# Altium schematic sheet riskybirdv3.SchDoc
size 594 x 420 mm
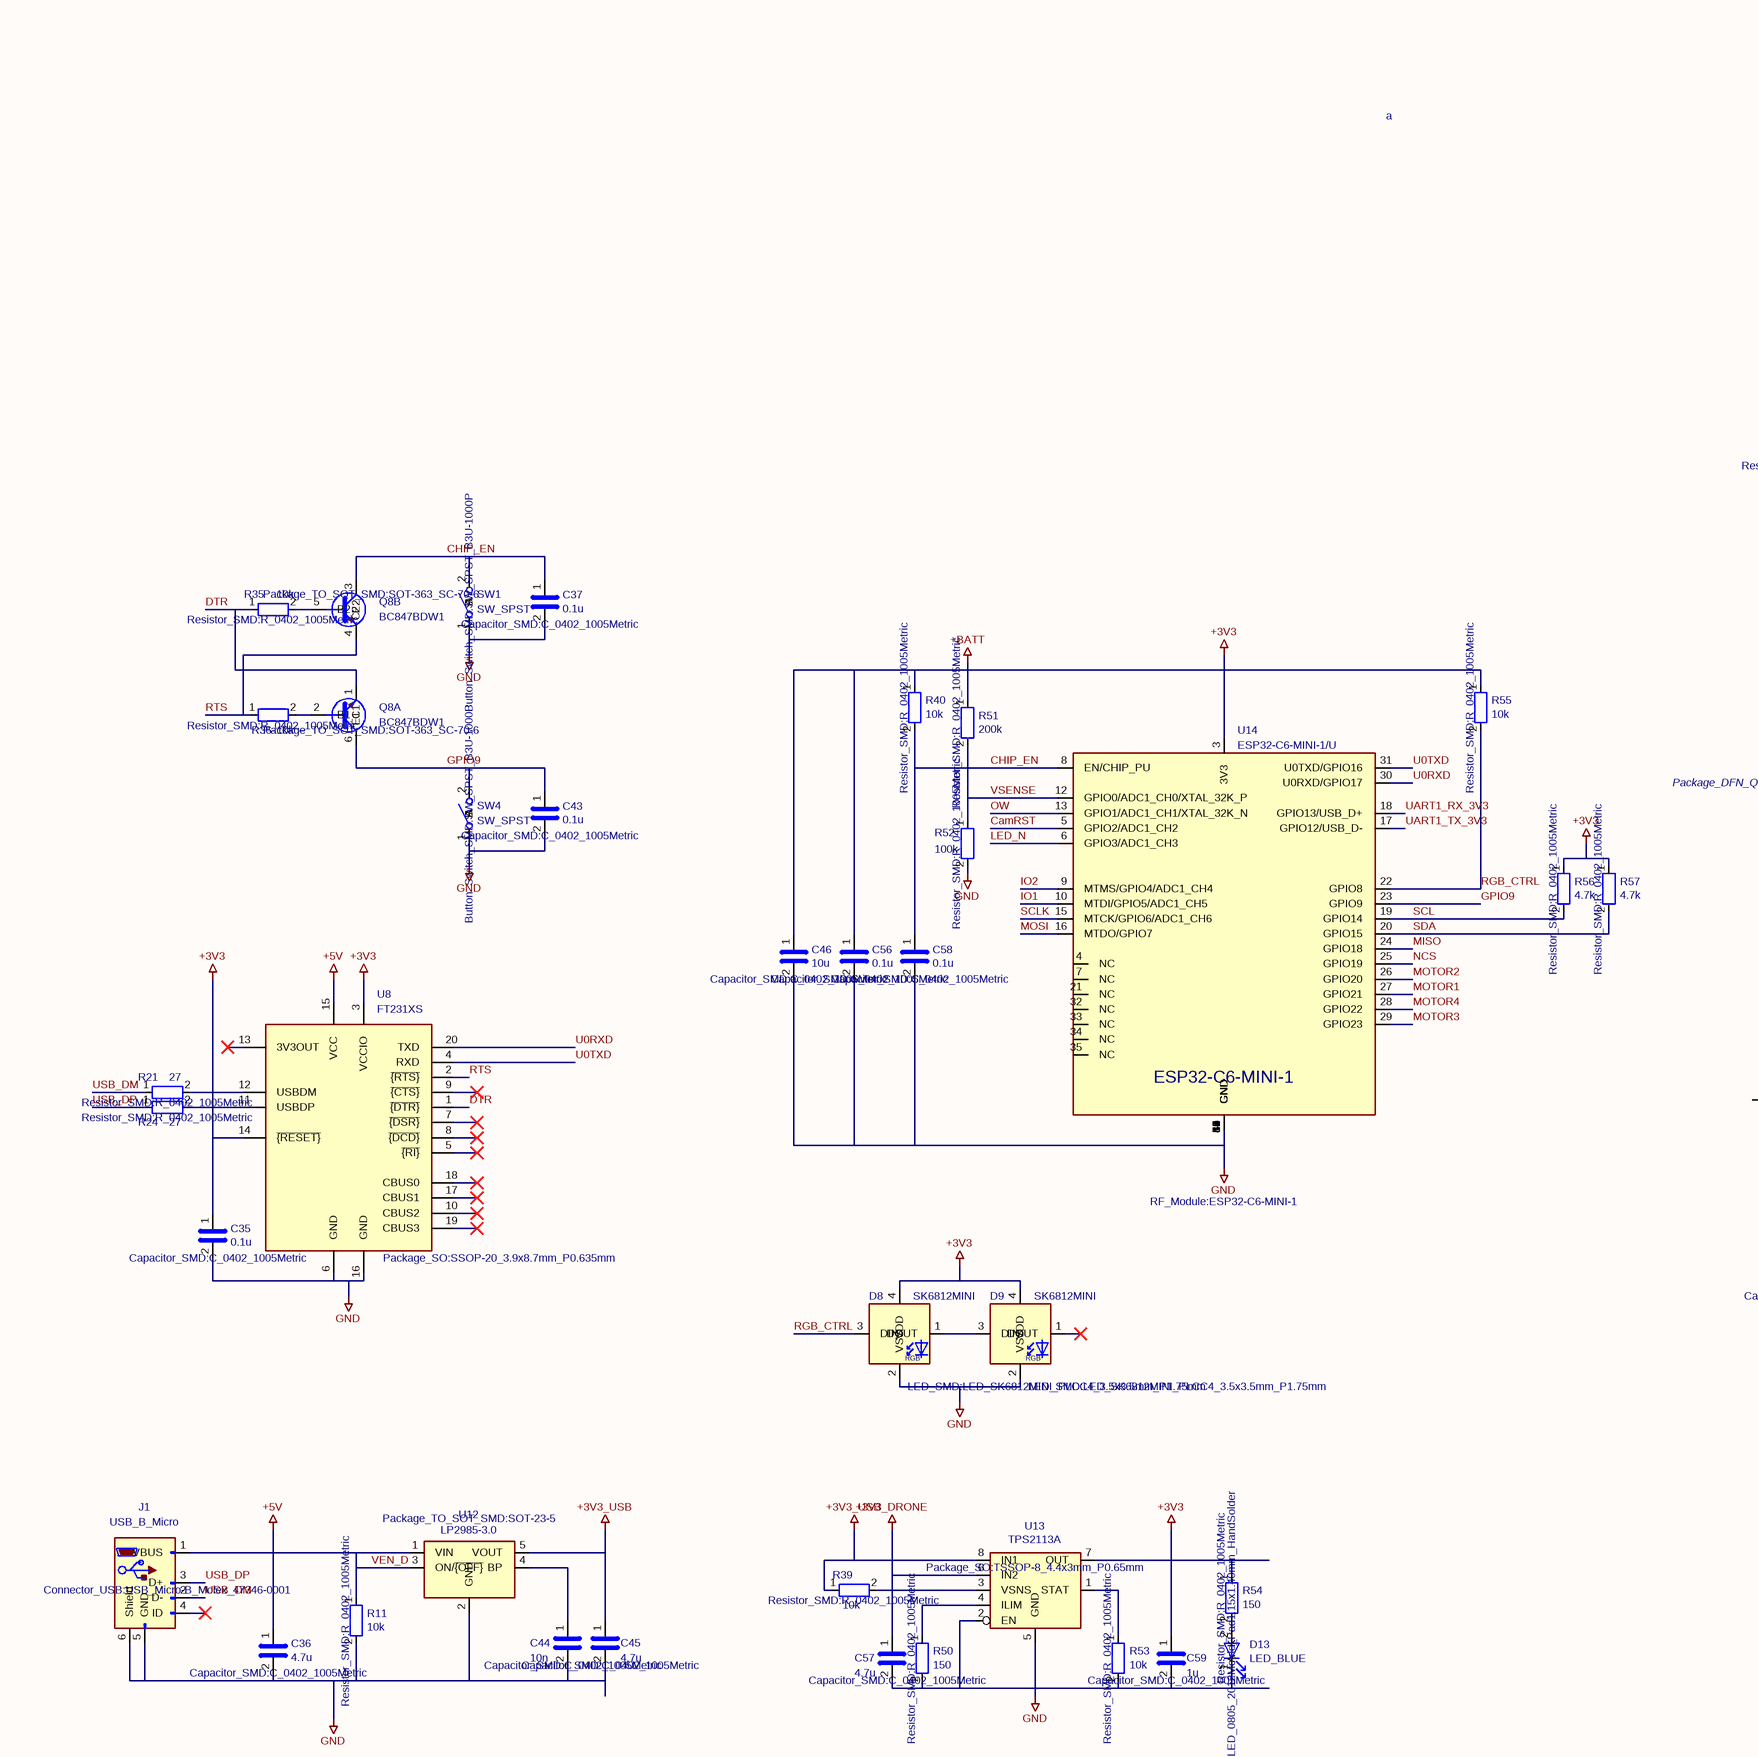
[diagram p0: riskybirdv3.SchDoc, row 1 of 4 left]
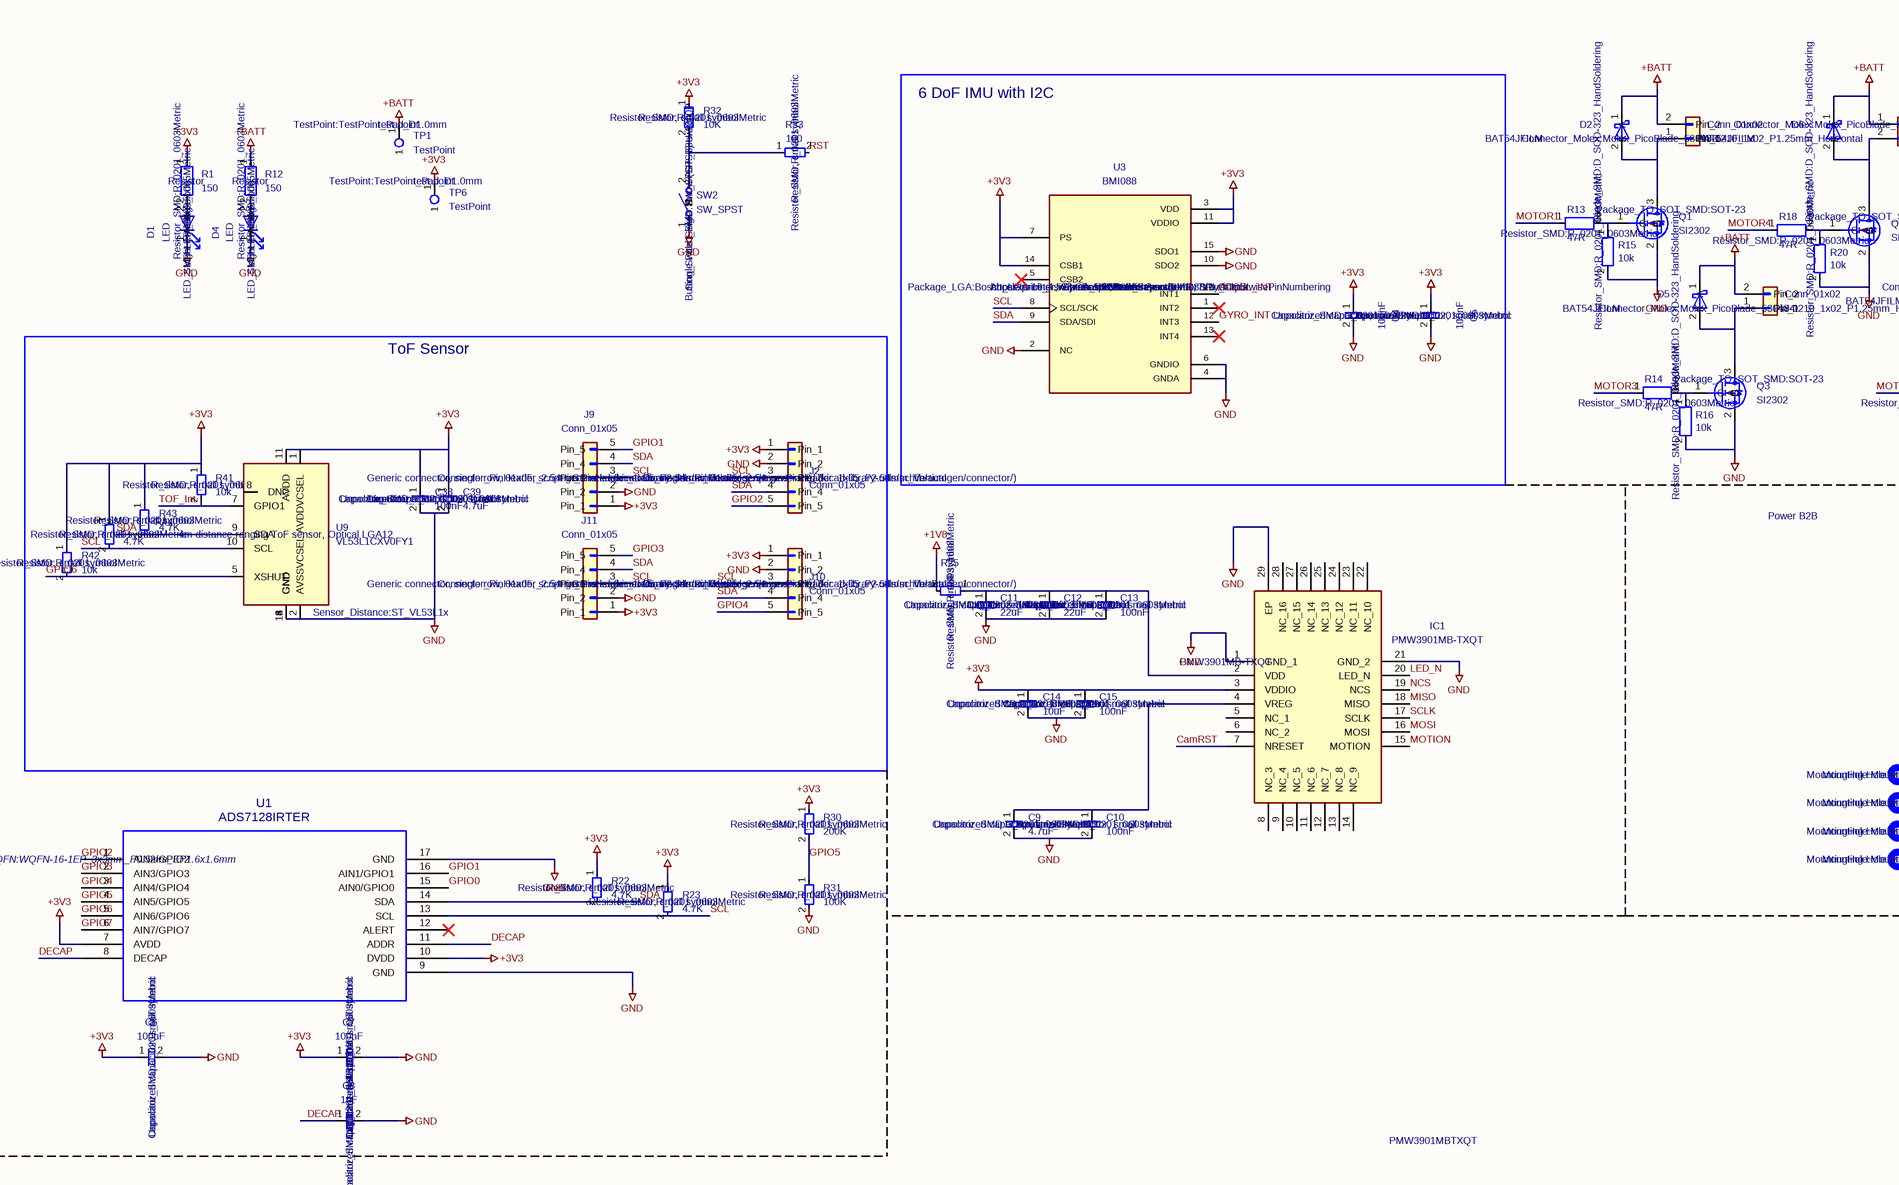
[diagram p1: riskybirdv3.SchDoc, row 1 of 4 middle]
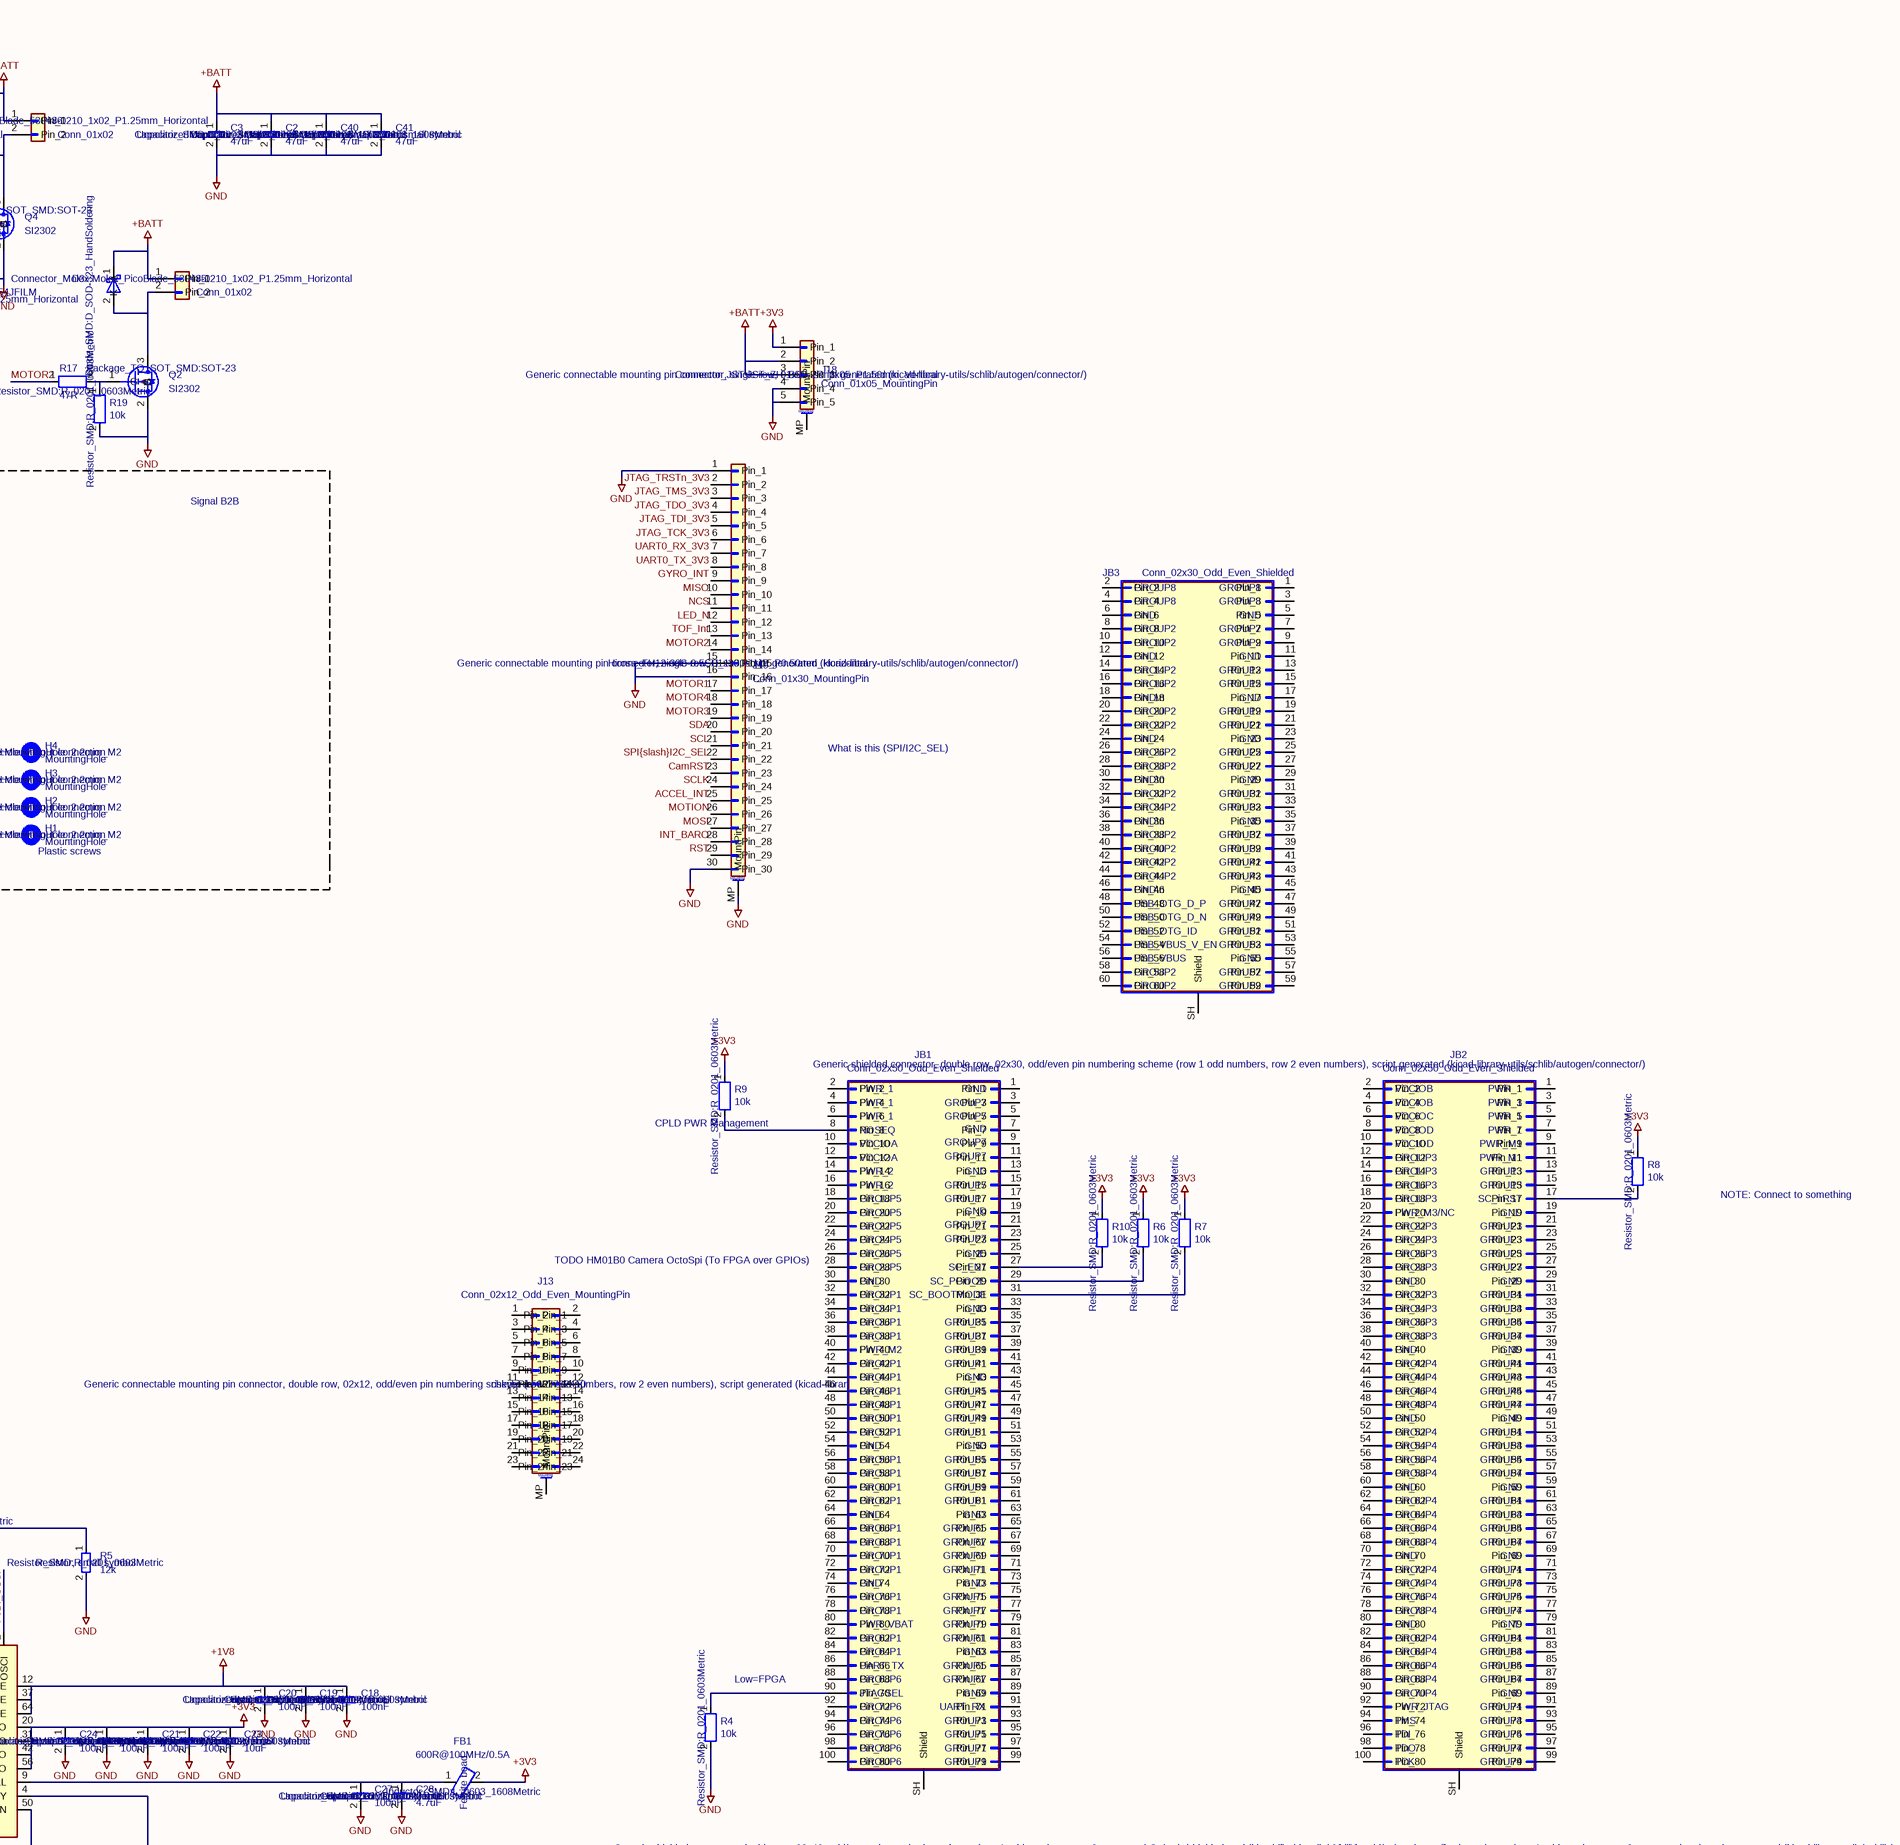
[diagram p2: riskybirdv3.SchDoc, row 1 of 4 right]
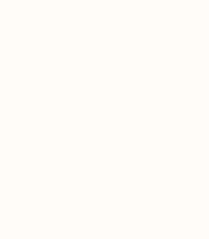
[diagram p3: riskybirdv3.SchDoc, row 2 of 4 left]
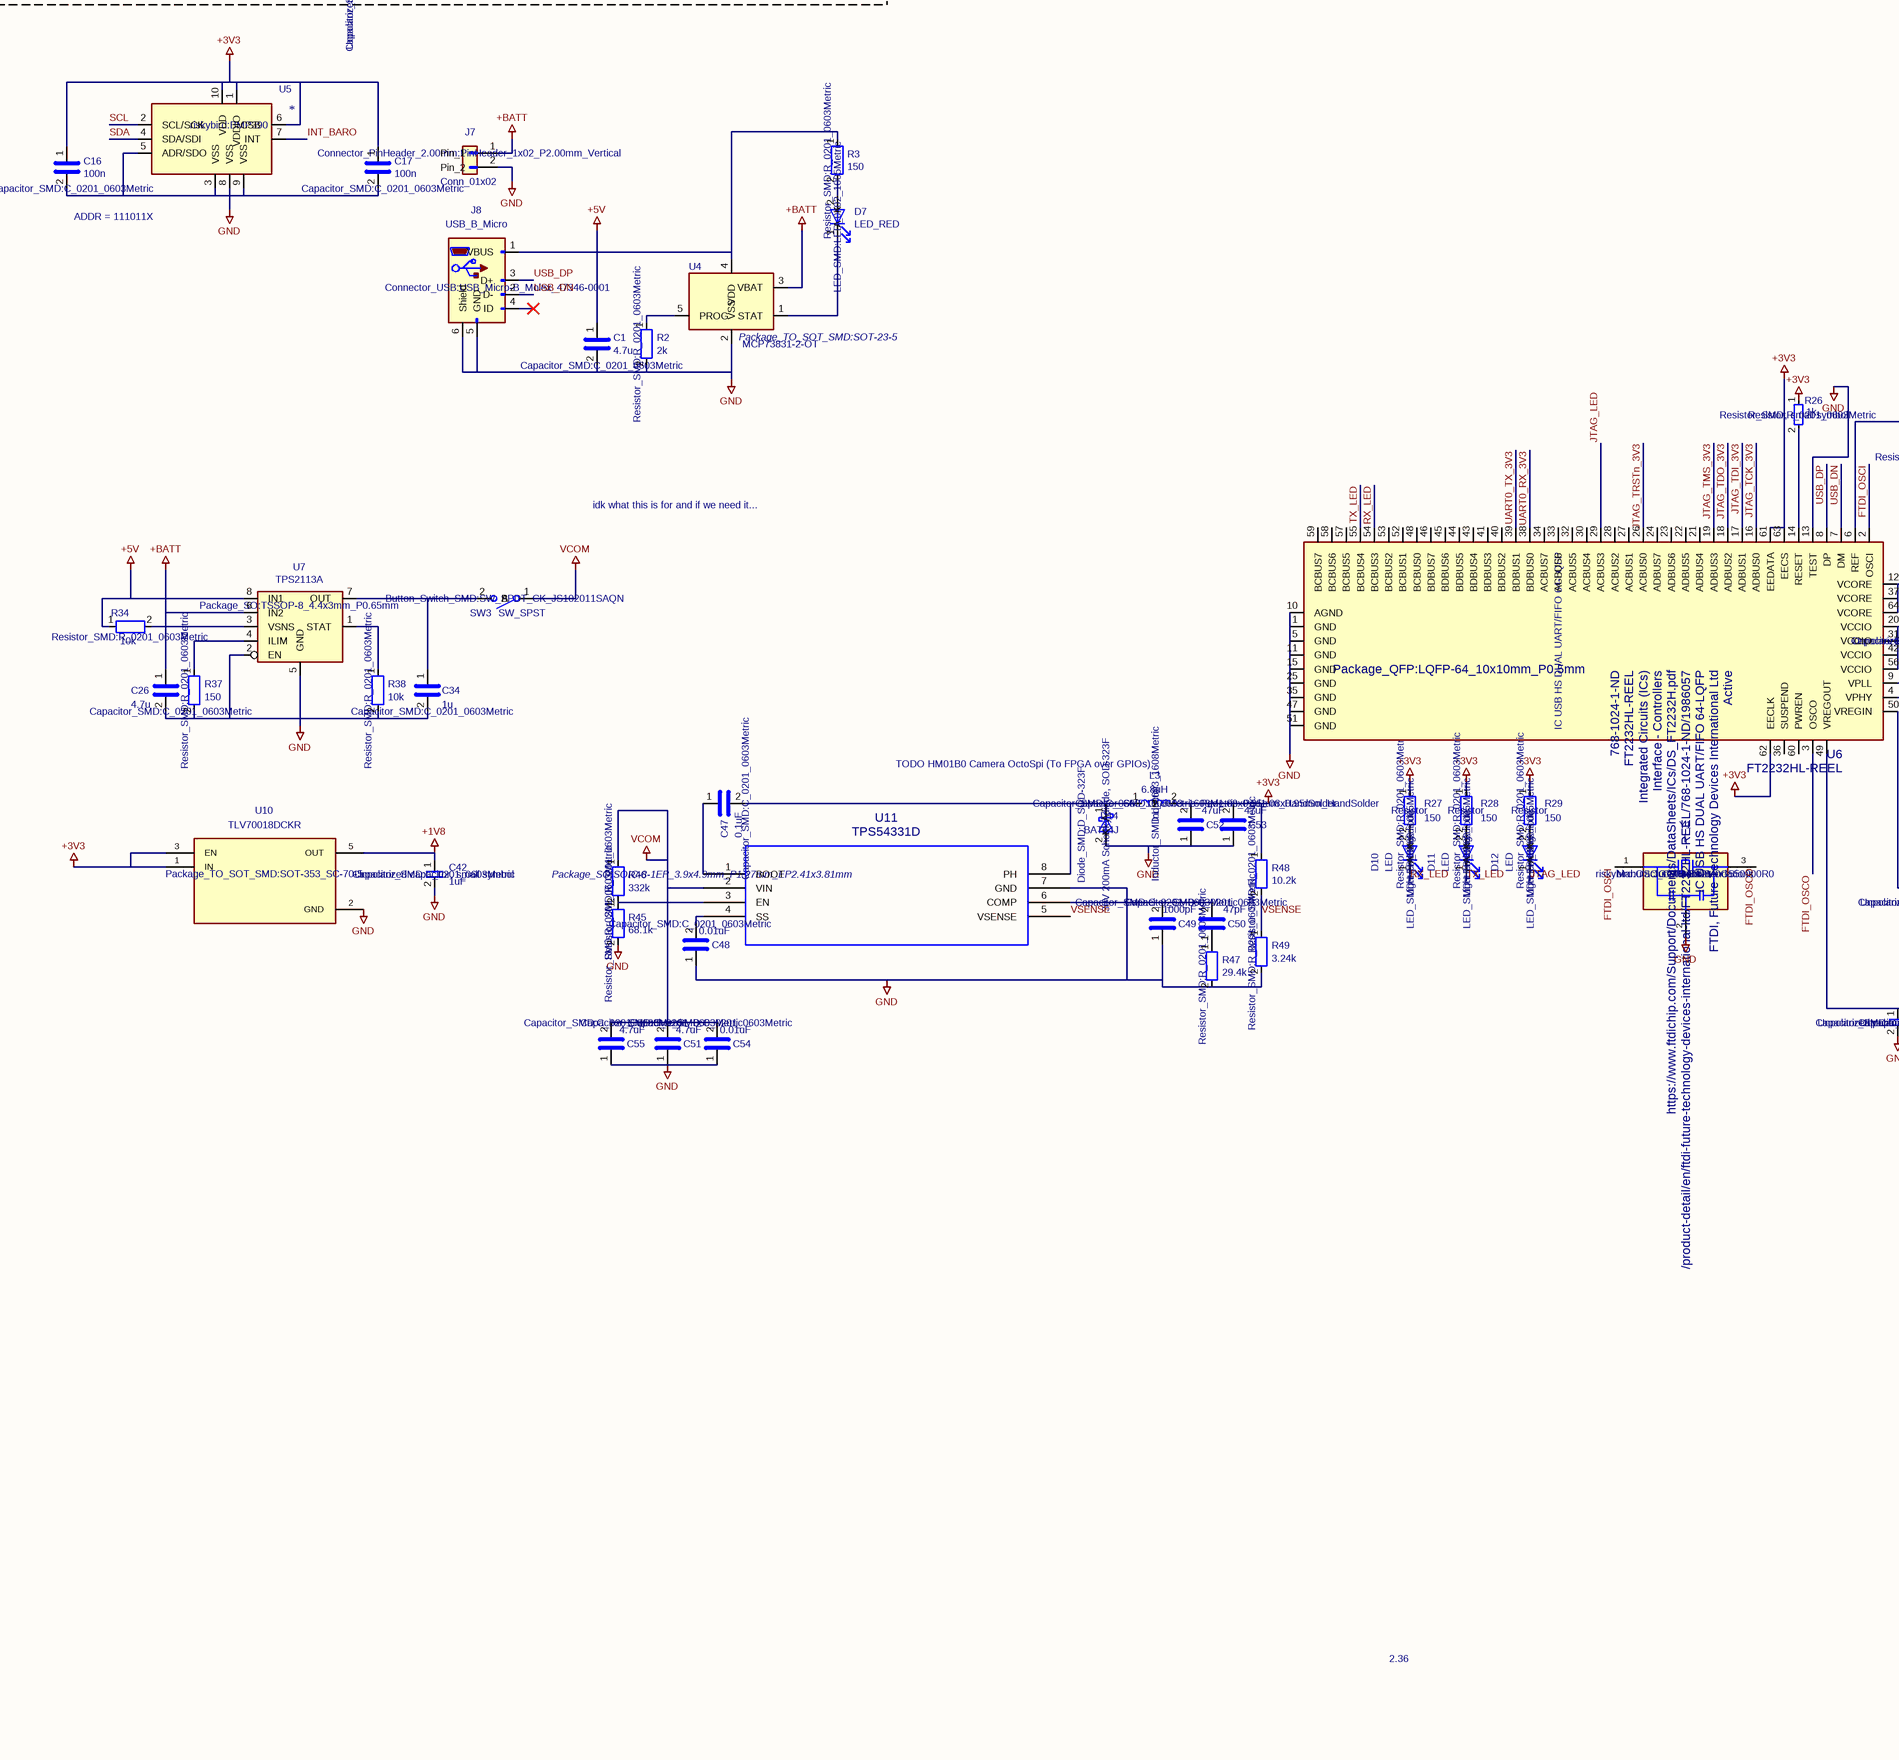
[diagram p4: riskybirdv3.SchDoc, row 2 of 4 middle]
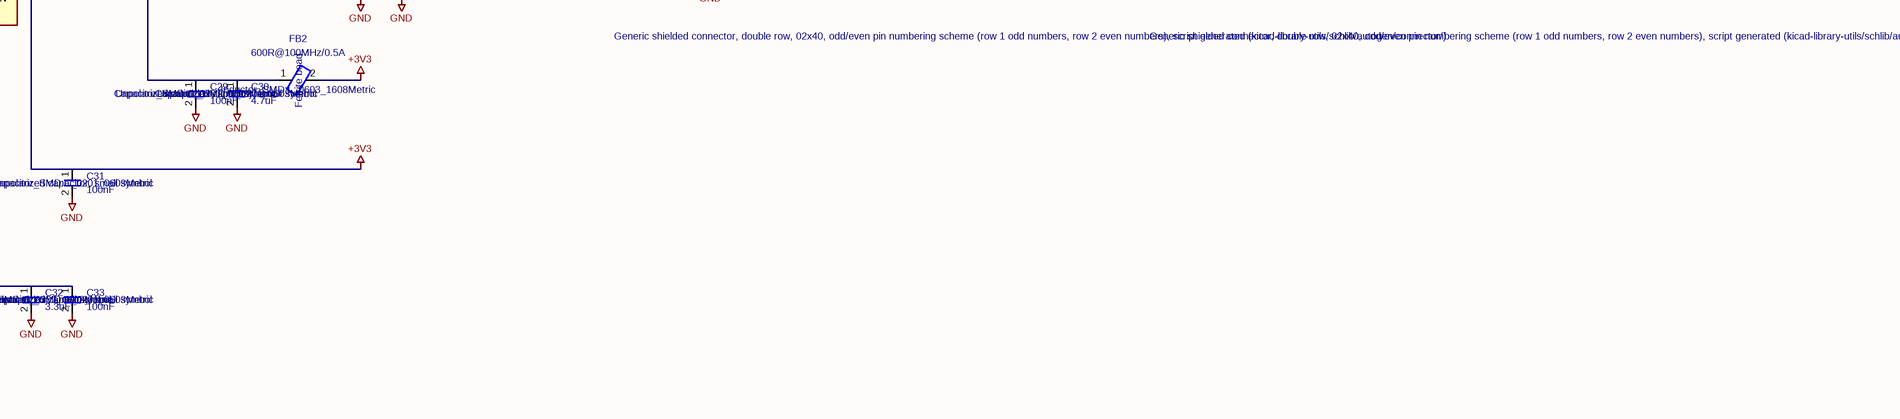
[diagram p5: riskybirdv3.SchDoc, row 2 of 4 right]
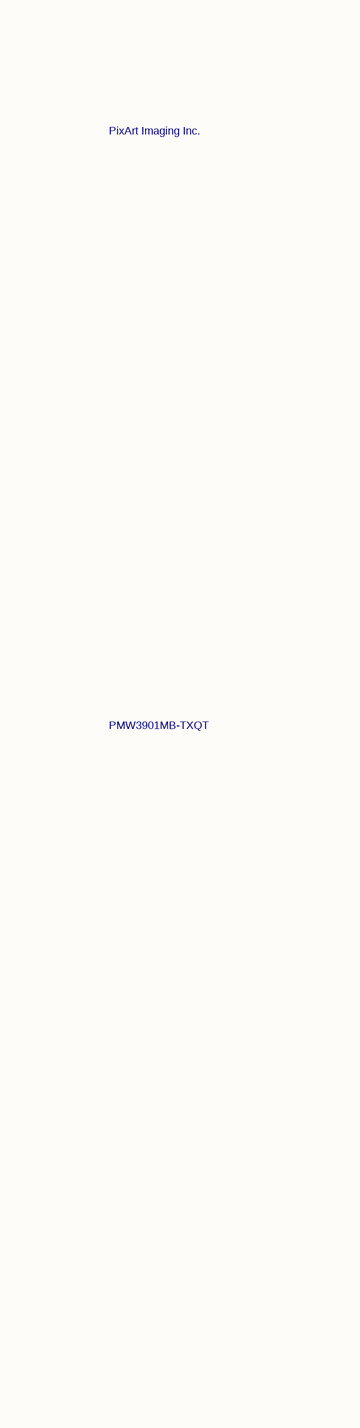
[diagram p6: riskybirdv3.SchDoc, row 3 of 4 middle]
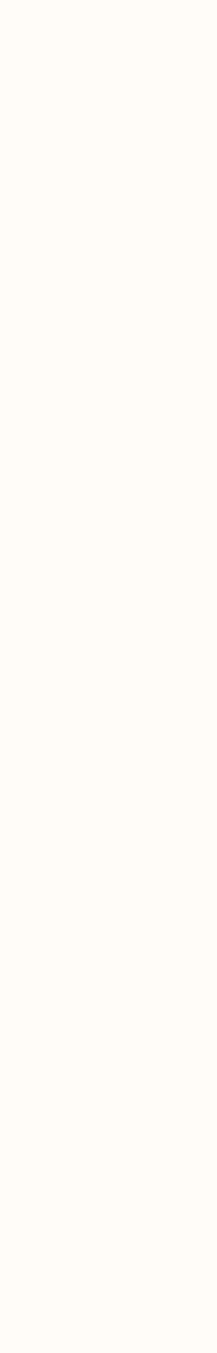
[diagram p7: riskybirdv3.SchDoc, row 4 of 4 middle]

## Parts
C1  Footprint: Capacitor_SMD:C_0201_0603Metric  [C_0201_0603Metric]  (hidden comment: 4.7u)
C2  Description: Unpolarized capacitor, small symbol  Footprint: Capacitor_SMD:C_0603_1608Metric  [C_0603_1608Metric]  (hidden comment: 47uF)
C3  Description: Unpolarized capacitor, small symbol  Footprint: Capacitor_SMD:C_0603_1608Metric  [C_0603_1608Metric]  (hidden comment: 47uF)
C4  Description: Unpolarized capacitor, small symbol  Footprint: Capacitor_SMD:C_0201_0603Metric  [C_0201_0603Metric]  (hidden comment: 100nF)
C5  Description: Unpolarized capacitor, small symbol  Footprint: Capacitor_SMD:C_0201_0603Metric  [C_0201_0603Metric]  (hidden comment: 100nF)
C6  Description: Unpolarized capacitor, small symbol  Footprint: Capacitor_SMD:C_0201_0603Metric  [C_0201_0603Metric]  (hidden comment: 100nF)
C7  Description: Unpolarized capacitor, small symbol  Footprint: Capacitor_SMD:C_0201_0603Metric  [C_0201_0603Metric]  (hidden comment: 100nF)
C8  Description: Unpolarized capacitor, small symbol  Footprint: Capacitor_SMD:C_0201_0603Metric  [C_0201_0603Metric]  (hidden comment: 1uF)
C9  Description: Unpolarized capacitor, small symbol  Footprint: Capacitor_SMD:C_0201_0603Metric  [C_0201_0603Metric]  (hidden comment: 4.7uF)
C10  Description: Unpolarized capacitor, small symbol  Footprint: Capacitor_SMD:C_0201_0603Metric  [C_0201_0603Metric]  (hidden comment: 100nF)
C11  Description: Unpolarized capacitor, small symbol  Footprint: Capacitor_SMD:C_0603_1608Metric  [C_0603_1608Metric]  (hidden comment: 22uF)
C12  Description: Unpolarized capacitor, small symbol  Footprint: Capacitor_SMD:C_0603_1608Metric  [C_0603_1608Metric]  (hidden comment: 22uF)
C13  Description: Unpolarized capacitor, small symbol  Footprint: Capacitor_SMD:C_0201_0603Metric  [C_0201_0603Metric]  (hidden comment: 100nF)
C14  Description: Unpolarized capacitor, small symbol  Footprint: Capacitor_SMD:C_0201_0603Metric  [C_0201_0603Metric]  (hidden comment: 10uF)
C15  Description: Unpolarized capacitor, small symbol  Footprint: Capacitor_SMD:C_0201_0603Metric  [C_0201_0603Metric]  (hidden comment: 100nF)
C16  Footprint: Capacitor_SMD:C_0201_0603Metric  [C_0201_0603Metric]  (hidden comment: 100n)
C17  Footprint: Capacitor_SMD:C_0201_0603Metric  [C_0201_0603Metric]  (hidden comment: 100n)
C18  Description: Unpolarized capacitor, small symbol  Footprint: Capacitor_SMD:C_0201_0603Metric  [C_0201_0603Metric]  (hidden comment: 100nF)
C19  Description: Unpolarized capacitor, small symbol  Footprint: Capacitor_SMD:C_0201_0603Metric  [C_0201_0603Metric]  (hidden comment: 100nF)
C20  Description: Unpolarized capacitor, small symbol  Footprint: Capacitor_SMD:C_0201_0603Metric  [C_0201_0603Metric]  (hidden comment: 100nF)
C21  Description: Unpolarized capacitor, small symbol  Footprint: Capacitor_SMD:C_0201_0603Metric  [C_0201_0603Metric]  (hidden comment: 100nF)
C22  Description: Unpolarized capacitor, small symbol  Footprint: Capacitor_SMD:C_0201_0603Metric  [C_0201_0603Metric]  (hidden comment: 100nF)
C23  Description: Unpolarized capacitor, small symbol  Footprint: Capacitor_SMD:C_0201_0603Metric  [C_0201_0603Metric]  (hidden comment: 10uF)
C24  Description: Unpolarized capacitor, small symbol  Footprint: Capacitor_SMD:C_0201_0603Metric  [C_0201_0603Metric]  (hidden comment: 100nF)
C25  Description: Unpolarized capacitor, small symbol  Footprint: Capacitor_SMD:C_0201_0603Metric  [C_0201_0603Metric]  (hidden comment: 100nF)
C26  Footprint: Capacitor_SMD:C_0201_0603Metric  [C_0201_0603Metric]  (hidden comment: 4.7u)
C27  Description: Unpolarized capacitor, small symbol  Footprint: Capacitor_SMD:C_0201_0603Metric  [C_0201_0603Metric]  (hidden comment: 100nF)
C28  Description: Unpolarized capacitor, small symbol  Footprint: Capacitor_SMD:C_0201_0603Metric  [C_0201_0603Metric]  (hidden comment: 4.7uF)
C29  Description: Unpolarized capacitor, small symbol  Footprint: Capacitor_SMD:C_0201_0603Metric  [C_0201_0603Metric]  (hidden comment: 100nF)
C30  Description: Unpolarized capacitor, small symbol  Footprint: Capacitor_SMD:C_0201_0603Metric  [C_0201_0603Metric]  (hidden comment: 4.7uF)
C31  Description: Unpolarized capacitor, small symbol  Footprint: Capacitor_SMD:C_0201_0603Metric  [C_0201_0603Metric]  (hidden comment: 100nF)
C32  Description: Unpolarized capacitor, small symbol  Footprint: Capacitor_SMD:C_0201_0603Metric  [C_0201_0603Metric]  (hidden comment: 3.3uF)
C33  Description: Unpolarized capacitor, small symbol  Footprint: Capacitor_SMD:C_0201_0603Metric  [C_0201_0603Metric]  (hidden comment: 100nF)
C34  Footprint: Capacitor_SMD:C_0201_0603Metric  [C_0201_0603Metric]  (hidden comment: 1u)
C35  Footprint: Capacitor_SMD:C_0402_1005Metric  [C_0402_1005Metric]  (hidden comment: 0.1u)
C36  Footprint: Capacitor_SMD:C_0402_1005Metric  [C_0402_1005Metric]  (hidden comment: 4.7u)
C37  Footprint: Capacitor_SMD:C_0402_1005Metric  [C_0402_1005Metric]  (hidden comment: 0.1u)
C38  Description: Unpolarized capacitor, small symbol  Footprint: Capacitor_SMD:C_0201_0603Metric  [C_0201_0603Metric]  (hidden comment: 100nF)
C39  Description: Unpolarized capacitor, small symbol  Footprint: Capacitor_SMD:C_0201_0603Metric  [C_0201_0603Metric]  (hidden comment: 4.7uF)
C40  Description: Unpolarized capacitor, small symbol  Footprint: Capacitor_SMD:C_0603_1608Metric  [C_0603_1608Metric]  (hidden comment: 47uF)
C41  Description: Unpolarized capacitor, small symbol  Footprint: Capacitor_SMD:C_0603_1608Metric  [C_0603_1608Metric]  (hidden comment: 47uF)
C42  Description: Unpolarized capacitor, small symbol  Footprint: Capacitor_SMD:C_0201_0603Metric  [C_0201_0603Metric]  (hidden comment: 1uF)
C43  Footprint: Capacitor_SMD:C_0402_1005Metric  [C_0402_1005Metric]  (hidden comment: 0.1u)
C44  Footprint: Capacitor_SMD:C_0402_1005Metric  [C_0402_1005Metric]  (hidden comment: 10n)
C45  Footprint: Capacitor_SMD:C_0402_1005Metric  [C_0402_1005Metric]  (hidden comment: 4.7u)
C46  Footprint: Capacitor_SMD:C_0402_1005Metric  [C_0402_1005Metric]  (hidden comment: 10u)
C47  Footprint: Capacitor_SMD:C_0201_0603Metric  [C_0201_0603Metric]  (hidden comment: 0.1uF)
C48  Footprint: Capacitor_SMD:C_0201_0603Metric  [C_0201_0603Metric]  (hidden comment: 0.01uF)
C49  Footprint: Capacitor_SMD:C_0201_0603Metric  [C_0201_0603Metric]  (hidden comment: 1000pF)
C50  Footprint: Capacitor_SMD:C_0201_0603Metric  [C_0201_0603Metric]  (hidden comment: 47pF)
C51  Footprint: Capacitor_SMD:C_0201_0603Metric  [C_0201_0603Metric]  (hidden comment: 4.7uF)
C52  Footprint: Capacitor_SMD:C_0603_1608Metric_Pad1.08x0.95mm_HandSolder  [C_0603_1608Metric_Pad1.08x0.95mm_HandSolder]  (hidden comment: 47uF)
C53  Footprint: Capacitor_SMD:C_0603_1608Metric_Pad1.08x0.95mm_HandSolder  [C_0603_1608Metric_Pad1.08x0.95mm_HandSolder]  (hidden comment: 47uF)
C54  Footprint: Capacitor_SMD:C_0201_0603Metric  [C_0201_0603Metric]  (hidden comment: 0.01uF)
C55  Footprint: Capacitor_SMD:C_0201_0603Metric  [C_0201_0603Metric]  (hidden comment: 4.7uF)
C56  Footprint: Capacitor_SMD:C_0402_1005Metric  [C_0402_1005Metric]  (hidden comment: 0.1u)
C57  Footprint: Capacitor_SMD:C_0402_1005Metric  [C_0402_1005Metric]  (hidden comment: 4.7u)
C58  Footprint: Capacitor_SMD:C_0402_1005Metric  [C_0402_1005Metric]  (hidden comment: 0.1u)
C59  Footprint: Capacitor_SMD:C_0402_1005Metric  [C_0402_1005Metric]  (hidden comment: 1u)
D1  Description: Light emitting diode  Sim.Pins: 1=K 2=A  Footprint: LED_SMD:LED_0402_1005Metric  [LED_0402_1005Metric]  (hidden comment: LED)
D2  Footprint: Diode_SMD:D_SOD-323_HandSoldering  [D_SOD-323_HandSoldering]  (hidden comment: BAT54JFILM)
D3  Footprint: Diode_SMD:D_SOD-323_HandSoldering  [D_SOD-323_HandSoldering]  (hidden comment: BAT54JFILM)
D4  Description: Light emitting diode  Sim.Pins: 1=K 2=A  Footprint: LED_SMD:LED_0402_1005Metric  [LED_0402_1005Metric]  (hidden comment: LED)
D5  Footprint: Diode_SMD:D_SOD-323_HandSoldering  [D_SOD-323_HandSoldering]  (hidden comment: BAT54JFILM)
D6  Footprint: Diode_SMD:D_SOD-323_HandSoldering  [D_SOD-323_HandSoldering]  (hidden comment: BAT54JFILM)
D7  Footprint: LED_SMD:LED_0402_1005Metric  [LED_0402_1005Metric]  (hidden comment: LED_RED)
D8  Footprint: LED_SMD:LED_SK6812MINI_PLCC4_3.5x3.5mm_P1.75mm  [LED_SK6812MINI_PLCC4_3.5x3.5mm_P1.75mm]  (hidden comment: SK6812MINI)
D9  Footprint: LED_SMD:LED_SK6812MINI_PLCC4_3.5x3.5mm_P1.75mm  [LED_SK6812MINI_PLCC4_3.5x3.5mm_P1.75mm]  (hidden comment: SK6812MINI)
D10  Description: Light emitting diode  Sim.Pins: 1=K 2=A  Footprint: LED_SMD:LED_0402_1005Metric  [LED_0402_1005Metric]  (hidden comment: LED)
D11  Description: Light emitting diode  Sim.Pins: 1=K 2=A  Footprint: LED_SMD:LED_0402_1005Metric  [LED_0402_1005Metric]  (hidden comment: LED)
D12  Description: Light emitting diode  Sim.Pins: 1=K 2=A  Footprint: LED_SMD:LED_0402_1005Metric  [LED_0402_1005Metric]  (hidden comment: LED)
D13  Footprint: LED_SMD:LED_0805_2012Metric_Pad1.15x1.40mm_HandSolder  [LED_0805_2012Metric_Pad1.15x1.40mm_HandSolder]  (hidden comment: LED_BLUE)
D14  Description: 30V 200mA Schottky diode, SOD-323F  Footprint: Diode_SMD:D_SOD-323F  [D_SOD-323F]  (hidden comment: BAT54J)
FB1  Description: Ferrite bead  Footprint: Inductor_SMD:L_0603_1608Metric  [L_0603_1608Metric]  (hidden comment: 600R@100MHz/0.5A)
FB2  Description: Ferrite bead  Footprint: Inductor_SMD:L_0603_1608Metric  [L_0603_1608Metric]  (hidden comment: 600R@100MHz/0.5A)
H1  Description: Mounting Hole without connection  Footprint: MountingHole:MountingHole_2.2mm_M2  [MountingHole_2.2mm_M2]  (hidden comment: MountingHole)
H2  Description: Mounting Hole without connection  Footprint: MountingHole:MountingHole_2.2mm_M2  [MountingHole_2.2mm_M2]  (hidden comment: MountingHole)
H3  Description: Mounting Hole without connection  Footprint: MountingHole:MountingHole_2.2mm_M2  [MountingHole_2.2mm_M2]  (hidden comment: MountingHole)
H4  Description: Mounting Hole without connection  Footprint: MountingHole:MountingHole_2.2mm_M2  [MountingHole_2.2mm_M2]  (hidden comment: MountingHole)
IC1  Height: 2.36  Manufacturer_Name: PixArt Imaging Inc.  [PMW3901MBTXQT]  (hidden comment: PMW3901MB-TXQT)
J1  Footprint: Connector_USB:USB_Micro-B_Molex_47346-0001  [USB_Micro-B_Molex_47346-0001]  (hidden comment: USB_B_Micro)
J2  Description: Generic connector, single row, 01x05, script generated (kicad-library-utils/schlib/autogen/connector/)  Footprint: Connector_PinHeader_2.54mm:PinHeader_1x05_P2.54mm_Vertical  [PinHeader_1x05_P2.54mm_Vertical]  (hidden comment: Conn_01x05)
J3  Footprint: Connector_Molex:Molex_PicoBlade_53048-0210_1x02_P1.25mm_Horizontal  [Molex_PicoBlade_53048-0210_1x02_P1.25mm_Horizontal]  (hidden comment: Conn_01x02)
J4  Footprint: Connector_Molex:Molex_PicoBlade_53048-0210_1x02_P1.25mm_Horizontal  [Molex_PicoBlade_53048-0210_1x02_P1.25mm_Horizontal]  (hidden comment: Conn_01x02)
J5  Footprint: Connector_Molex:Molex_PicoBlade_53048-0210_1x02_P1.25mm_Horizontal  [Molex_PicoBlade_53048-0210_1x02_P1.25mm_Horizontal]  (hidden comment: Conn_01x02)
J6  Footprint: Connector_Molex:Molex_PicoBlade_53048-0210_1x02_P1.25mm_Horizontal  [Molex_PicoBlade_53048-0210_1x02_P1.25mm_Horizontal]  (hidden comment: Conn_01x02)
J7  Footprint: Connector_PinHeader_2.00mm:PinHeader_1x02_P2.00mm_Vertical  [PinHeader_1x02_P2.00mm_Vertical]  (hidden comment: Conn_01x02)
J8  Footprint: Connector_USB:USB_Micro-B_Molex_47346-0001  [USB_Micro-B_Molex_47346-0001]  (hidden comment: USB_B_Micro)
J9  Description: Generic connector, single row, 01x05, script generated (kicad-library-utils/schlib/autogen/connector/)  Footprint: Connector_PinHeader_2.54mm:PinHeader_1x05_P2.54mm_Vertical  [PinHeader_1x05_P2.54mm_Vertical]  (hidden comment: Conn_01x05)
J10  Description: Generic connector, single row, 01x05, script generated (kicad-library-utils/schlib/autogen/connector/)  Footprint: Connector_PinHeader_2.54mm:PinHeader_1x05_P2.54mm_Vertical  [PinHeader_1x05_P2.54mm_Vertical]  (hidden comment: Conn_01x05)
J11  Description: Generic connector, single row, 01x05, script generated (kicad-library-utils/schlib/autogen/connector/)  Footprint: Connector_PinHeader_2.54mm:PinHeader_1x05_P2.54mm_Vertical  [PinHeader_1x05_P2.54mm_Vertical]  (hidden comment: Conn_01x05)
J13  Description: Generic connectable mounting pin connector, double row, 02x12, odd/even pin numbering scheme (row 1 odd numbers, row 2 even numbers), script generated (kicad-library-utils/schlib/autogen/connector/)  Footprint: riskybird:5037762410  [5037762410]  (hidden comment: Conn_02x12_Odd_Even_MountingPin)
J18  Description: Generic connectable mounting pin connector, single row, 01x05, script generated (kicad-library-utils/schlib/autogen/connector/)  Footprint: Connector_JST:JST_ZH_B5B-ZR_1x05_P1.50mm_Vertical  [JST_ZH_B5B-ZR_1x05_P1.50mm_Vertical]  (hidden comment: Conn_01x05_MountingPin)
J19  Description: Generic connectable mounting pin connector, single row, 01x30, script generated (kicad-library-utils/schlib/autogen/connector/)  [Hirose_FH12-30S-0.5SH_1x30-1MP_P0.50mm_Horizontal]  (hidden comment: Conn_01x30_MountingPin)
JB1  Description: Generic shielded connector, double row, 02x40, odd/even pin numbering scheme (row 1 odd numbers, row 2 even numbers), script generated (kicad-library-utils/schlib/autogen/connector/)  (hidden comment: Conn_02x50_Odd_Even_Shielded)
JB2  Description: Generic shielded connector, double row, 02x40, odd/even pin numbering scheme (row 1 odd numbers, row 2 even numbers), script generated (kicad-library-utils/schlib/autogen/connector/)  (hidden comment: Conn_02x50_Odd_Even_Shielded)
JB3  Description: Generic shielded connector, double row, 02x30, odd/even pin numbering scheme (row 1 odd numbers, row 2 even numbers), script generated (kicad-library-utils/schlib/autogen/connector/)  (hidden comment: Conn_02x30_Odd_Even_Shielded)
L3  Description: Inductor  Footprint: Inductor_SMD:L_0603_1608Metric  [L_0603_1608Metric]  (hidden comment: 6.8uH)
Q1  Footprint: Package_TO_SOT_SMD:SOT-23  [SOT-23]  (hidden comment: SI2302)
Q2  Footprint: Package_TO_SOT_SMD:SOT-23  [SOT-23]  (hidden comment: SI2302)
Q3  Footprint: Package_TO_SOT_SMD:SOT-23  [SOT-23]  (hidden comment: SI2302)
Q4  Footprint: Package_TO_SOT_SMD:SOT-23  [SOT-23]  (hidden comment: SI2302)
Q8  Footprint: Package_TO_SOT_SMD:SOT-363_SC-70-6  [SOT-363_SC-70-6]  (hidden comment: BC847BDW1)  (parts A,B of 2)
R1  Description: Resistor  Footprint: Resistor_SMD:R_0201_0603Metric  [R_0201_0603Metric]  (hidden comment: 150)
R2  Footprint: Resistor_SMD:R_0201_0603Metric  [R_0201_0603Metric]  (hidden comment: 2k)
R3  Footprint: Resistor_SMD:R_0201_0603Metric  [R_0201_0603Metric]  (hidden comment: 150)
R4  Footprint: Resistor_SMD:R_0201_0603Metric  [R_0201_0603Metric]  (hidden comment: 10k)
R5  Description: Resistor, small symbol  Footprint: Resistor_SMD:R_0201_0603Metric  [R_0201_0603Metric]  (hidden comment: 12k)
R6  Footprint: Resistor_SMD:R_0201_0603Metric  [R_0201_0603Metric]  (hidden comment: 10k)
R7  Footprint: Resistor_SMD:R_0201_0603Metric  [R_0201_0603Metric]  (hidden comment: 10k)
R8  Footprint: Resistor_SMD:R_0201_0603Metric  [R_0201_0603Metric]  (hidden comment: 10k)
R9  Footprint: Resistor_SMD:R_0201_0603Metric  [R_0201_0603Metric]  (hidden comment: 10k)
R10  Footprint: Resistor_SMD:R_0201_0603Metric  [R_0201_0603Metric]  (hidden comment: 10k)
R11  Footprint: Resistor_SMD:R_0402_1005Metric  [R_0402_1005Metric]  (hidden comment: 10k)
R12  Description: Resistor  Footprint: Resistor_SMD:R_0201_0603Metric  [R_0201_0603Metric]  (hidden comment: 150)
R13  Footprint: Resistor_SMD:R_0201_0603Metric  [R_0201_0603Metric]  (hidden comment: 47R)
R14  Footprint: Resistor_SMD:R_0201_0603Metric  [R_0201_0603Metric]  (hidden comment: 47R)
R15  Footprint: Resistor_SMD:R_0201_0603Metric  [R_0201_0603Metric]  (hidden comment: 10k)
R16  Footprint: Resistor_SMD:R_0201_0603Metric  [R_0201_0603Metric]  (hidden comment: 10k)
R17  Footprint: Resistor_SMD:R_0201_0603Metric  [R_0201_0603Metric]  (hidden comment: 47R)
R18  Footprint: Resistor_SMD:R_0201_0603Metric  [R_0201_0603Metric]  (hidden comment: 47R)
R19  Footprint: Resistor_SMD:R_0201_0603Metric  [R_0201_0603Metric]  (hidden comment: 10k)
R20  Footprint: Resistor_SMD:R_0201_0603Metric  [R_0201_0603Metric]  (hidden comment: 10k)
R21  Footprint: Resistor_SMD:R_0402_1005Metric  [R_0402_1005Metric]  (hidden comment: 27)
R22  Description: Resistor, small symbol  Footprint: Resistor_SMD:R_0201_0603Metric  [R_0201_0603Metric]  (hidden comment: 4.7K)
R23  Description: Resistor, small symbol  Footprint: Resistor_SMD:R_0201_0603Metric  [R_0201_0603Metric]  (hidden comment: 4.7K)
R24  Footprint: Resistor_SMD:R_0402_1005Metric  [R_0402_1005Metric]  (hidden comment: 27)
R25  Description: Resistor, small symbol  Footprint: Resistor_SMD:R_0603_1608Metric  [R_0603_1608Metric]  (hidden comment: 3)
R26  Description: Resistor, small symbol  Footprint: Resistor_SMD:R_0201_0603Metric  [R_0201_0603Metric]  (hidden comment: 1k)
R27  Description: Resistor  Footprint: Resistor_SMD:R_0201_0603Metric  [R_0201_0603Metric]  (hidden comment: 150)
R28  Description: Resistor  Footprint: Resistor_SMD:R_0201_0603Metric  [R_0201_0603Metric]  (hidden comment: 150)
R29  Description: Resistor  Footprint: Resistor_SMD:R_0201_0603Metric  [R_0201_0603Metric]  (hidden comment: 150)
R30  Description: Resistor, small symbol  Footprint: Resistor_SMD:R_0201_0603Metric  [R_0201_0603Metric]  (hidden comment: 200K)
R31  Description: Resistor, small symbol  Footprint: Resistor_SMD:R_0201_0603Metric  [R_0201_0603Metric]  (hidden comment: 100K)
R32  Description: Resistor, small symbol  Footprint: Resistor_SMD:R_0201_0603Metric  [R_0201_0603Metric]  (hidden comment: 10K)
R33  Description: Resistor, small symbol  Footprint: Resistor_SMD:R_0201_0603Metric  [R_0201_0603Metric]  (hidden comment: 100)
R34  Footprint: Resistor_SMD:R_0201_0603Metric  [R_0201_0603Metric]  (hidden comment: 10k)
R35  Footprint: Resistor_SMD:R_0402_1005Metric  [R_0402_1005Metric]  (hidden comment: 10k)
R36  Footprint: Resistor_SMD:R_0402_1005Metric  [R_0402_1005Metric]  (hidden comment: 10k)
R37  Footprint: Resistor_SMD:R_0201_0603Metric  [R_0201_0603Metric]  (hidden comment: 150)
R38  Footprint: Resistor_SMD:R_0201_0603Metric  [R_0201_0603Metric]  (hidden comment: 10k)
R39  Footprint: Resistor_SMD:R_0402_1005Metric  [R_0402_1005Metric]  (hidden comment: 10k)
R40  Footprint: Resistor_SMD:R_0402_1005Metric  [R_0402_1005Metric]  (hidden comment: 10k)
R41  Description: Resistor, small symbol  Footprint: Resistor_SMD:R_0201_0603Metric  [R_0201_0603Metric]  (hidden comment: 10k)
R42  Description: Resistor, small symbol  Footprint: Resistor_SMD:R_0201_0603Metric  [R_0201_0603Metric]  (hidden comment: 10k)
R43  Description: Resistor, small symbol  Footprint: Resistor_SMD:R_0201_0603Metric  [R_0201_0603Metric]  (hidden comment: 4.7K)
R44  Description: Resistor, small symbol  Footprint: Resistor_SMD:R_0201_0603Metric  [R_0201_0603Metric]  (hidden comment: 4.7K)
R45  Footprint: Resistor_SMD:R_0201_0603Metric  [R_0201_0603Metric]  (hidden comment: 68.1k)
R46  Footprint: Resistor_SMD:R_0201_0603Metric  [R_0201_0603Metric]  (hidden comment: 332k)
R47  Footprint: Resistor_SMD:R_0201_0603Metric  [R_0201_0603Metric]  (hidden comment: 29.4k)
R48  Footprint: Resistor_SMD:R_0201_0603Metric  [R_0201_0603Metric]  (hidden comment: 10.2k)
R49  Footprint: Resistor_SMD:R_0201_0603Metric  [R_0201_0603Metric]  (hidden comment: 3.24k)
R50  Footprint: Resistor_SMD:R_0402_1005Metric  [R_0402_1005Metric]  (hidden comment: 150)
R51  Footprint: Resistor_SMD:R_0402_1005Metric  [R_0402_1005Metric]  (hidden comment: 200k)
R52  Footprint: Resistor_SMD:R_0402_1005Metric  [R_0402_1005Metric]  (hidden comment: 100k)
R53  Footprint: Resistor_SMD:R_0402_1005Metric  [R_0402_1005Metric]  (hidden comment: 10k)
R54  Footprint: Resistor_SMD:R_0402_1005Metric  [R_0402_1005Metric]  (hidden comment: 150)
R55  Footprint: Resistor_SMD:R_0402_1005Metric  [R_0402_1005Metric]  (hidden comment: 10k)
R56  Footprint: Resistor_SMD:R_0402_1005Metric  [R_0402_1005Metric]  (hidden comment: 4.7k)
R57  Footprint: Resistor_SMD:R_0402_1005Metric  [R_0402_1005Metric]  (hidden comment: 4.7k)
SW1  Footprint: Button_Switch_SMD:SW_SPST_B3U-1000P  [SW_SPST_B3U-1000P]  (hidden comment: SW_SPST)
SW2  Description: Single Pole Single Throw (SPST) switch  Footprint: Button_Switch_SMD:SW_SPST_B3U-1000P  [SW_SPST_B3U-1000P]  (hidden comment: SW_SPST)
SW3  Footprint: Button_Switch_SMD:SW_SPDT_CK_JS102011SAQN  [SW_SPDT_CK_JS102011SAQN]  (hidden comment: SW_SPST)
SW4  Footprint: Button_Switch_SMD:SW_SPST_B3U-1000P  [SW_SPST_B3U-1000P]  (hidden comment: SW_SPST)
TP1  Description: test point  Footprint: TestPoint:TestPoint_Pad_D1.0mm  [TestPoint_Pad_D1.0mm]  (hidden comment: TestPoint)
TP6  Description: test point  Footprint: TestPoint:TestPoint_Pad_D1.0mm  [TestPoint_Pad_D1.0mm]  (hidden comment: TestPoint)
U1  Footprint: Package_DFN_QFN:WQFN-16-1EP_3x3mm_P0.5mm_EP1.6x1.6mm  [WQFN-16-1EP_3x3mm_P0.5mm_EP1.6x1.6mm]  (hidden comment: ADS7128IRTER)
U3  Description: Accelerometer, Gyroscope, 6 Axis Sensor I²C, SPI Output  MF: Bosch Sensortec  PACKAGE: VFLGA-16 Bosch Sensortec  PRICE: None  AVAILABILITY: In Stock  Footprint: Package_LGA:Bosch_LGA-16_4.5x3mm_P0.5mm_LayoutBorder7x1y_ClockwisePinNumbering  [Bosch_LGA-16_4.5x3mm_P0.5mm_LayoutBorder7x1y_ClockwisePinNumbering]  (hidden comment: BMI088)
U4  Footprint: Package_TO_SOT_SMD:SOT-23-5  [SOT-23-5]  (hidden comment: MCP73831-2-OT)
U5  *  Footprint: riskybird:BMP390  [BMP390]
U6  Description: IC USB HS DUAL UART/FIFO 64-LQFP  Digi-Key_PN: 768-1024-1-ND  Category: Integrated Circuits (ICs)  Family: Interface - Controllers  DK_Detail_Page: /product-detail/en/ftdi-future-technology-devices-international-ltd/FT2232HL-REEL/768-1024-1-ND/1986057  Manufacturer: FTDI, Future Technology Devices International Ltd  Status: Active  Footprint: Package_QFP:LQFP-64_10x10mm_P0.5mm  [LQFP-64_10x10mm_P0.5mm]  (hidden comment: FT2232HL-REEL)
U7  Footprint: Package_SO:TSSOP-8_4.4x3mm_P0.65mm  [TSSOP-8_4.4x3mm_P0.65mm]  (hidden comment: TPS2113A)
U8  Footprint: Package_SO:SSOP-20_3.9x8.7mm_P0.635mm  [SSOP-20_3.9x8.7mm_P0.635mm]  (hidden comment: FT231XS)
U9  Description: 4m distance ranging ToF sensor, Optical LGA12  Footprint: Sensor_Distance:ST_VL53L1x  [ST_VL53L1x]  (hidden comment: VL53L1CXV0FY1)
U10  Footprint: Package_TO_SOT_SMD:SOT-353_SC-70-5  [SOT-353_SC-70-5]  (hidden comment: TLV70018DCKR)
U11  Footprint: Package_SO:SOIC-8-1EP_3.9x4.9mm_P1.27mm_EP2.41x3.81mm  [SOIC-8-1EP_3.9x4.9mm_P1.27mm_EP2.41x3.81mm]  (hidden comment: TPS54331D)
U12  Footprint: Package_TO_SOT_SMD:SOT-23-5  [SOT-23-5]  (hidden comment: LP2985-3.0)
U13  Footprint: Package_SO:TSSOP-8_4.4x3mm_P0.65mm  [TSSOP-8_4.4x3mm_P0.65mm]  (hidden comment: TPS2113A)
U14  Footprint: RF_Module:ESP32-C6-MINI-1  [ESP32-C6-MINI-1]  (hidden comment: ESP32-C6-MINI-1/U)
Y1  PARTREV: JGC42-8858A  MANUFACTURER: Murata  MAXIMUM_PACKAGE_HEIGHT: 0.8mm  STANDARD: Manufacturer Recomendations  Footprint: riskybird:OSC_CSTNE12M0G550000R0  [OSC_CSTNE12M0G550000R0]  (hidden comment: f)

## Blocks framed on the sheet
6 DoF IMU with I2C /: C4 C5 U3
ToF Sensor: C38 C39 J2 J9-J11 R41-R44 U9

## Nets
+1V8: C18.1 C19.1 C20.1 C42.1 R25.2 U6.12(VCORE) U6.37(VCORE) U6.64(VCORE) U10.5(OUT)
+3V3: C4.1 C5.1 C6.1 C7.1 C14.1 C15.1 C16.1 C17.1 C21.1 C22.1 C23.1 C24.1 C25.1 C31.1 C35.1 C38.1 C39.1 C46.1 C52.2 C53.2 C56.1 C59.1 D8.4(VDD) D9.4(VDD) FB1.2 FB2.2 IC1.3(VDDIO) J2.1(Pin_1) J9.1(Pin_1) J10.1(Pin_1) J11.1(Pin_1) J18.1(Pin_1) L3.2 R1.1 R6.1 R7.1 R8.1 R9.1 R10.1 R22.1 R23.1 R26.1 R27.1 R28.1 R29.1 R30.1 R32.1 R40.1 R41.1 R42.1 R43.1 R44.1 R48.1 R54.1 R55.1 R56.1 R57.1 TP6.1 U1.7(AVDD) U1.10(DVDD) U3.3(VDD) U3.7(PS) U3.11(VDDIO) U3.14(CSB1) U5.1(VDDIO) U5.6(CSB) U5.10(VDD) U6.20(VCCIO) U6.31(VCCIO) U6.42(VCCIO) U6.50(VREGIN) U6.56(VCCIO) U6.61(EEDATA) U6.62(EECLK) U6.63(EECS) U8.3(VCCIO) U8.14(~{{RESET}}) U9.1(AVDDVCSEL) U9.11(AVDD) U10.1(IN) U10.3(EN) U13.7(OUT) U14.3(3V3)
+3V3_DRONE: C57.1 U13.6(IN2)
+3V3_USB: C45.1 R39.1 U12.5(VOUT) U13.8(IN1)
+BATT: C2.1 C3.1 C26.1 C40.1 C41.1 D2.1(K) D3.1(K) D5.1(K) D6.1(K) J3.2(Pin_2) J4.2(Pin_2) J5.1(Pin_1) J6.1(Pin_1) J7.1(Pin_1) J18.2(Pin_2) J18.3(Pin_3) R12.1 R51.1 TP1.1 U4.3(VBAT) U7.6(IN2)
GND: C1.2 C2.2 C3.2 C4.2 C5.2 C6.2 C7.2 C8.2 C9.2 C10.2 C11.2 C12.2 C13.2 C14.2 C15.2 C16.2 C17.2 C18.2 C19.2 C20.2 C21.2 C22.2 C23.2 C24.2 C25.2 C26.2 C27.2 C28.2 C29.2 C30.2 C31.2 C32.2 C33.2 C34.2 C35.2 C36.2 C37.2 C38.2 C39.2 C40.2 C41.2 C42.2 C43.2 C44.2 C45.2 C46.2 C48.1 C49.1 C51.1 C52.1 C53.1 C54.1 C55.1 C56.2 C57.2 C58.2 C59.2 D1.1(K) D4.1(K) D8.2(VSS) D9.2(VSS) D13.1(K) D14.2(A) IC1.1(GND_1) IC1.21(GND_2) IC1.29(EP) J1.5(GND) J1.6(Shield) J2.2(Pin_2) J7.2(Pin_2) J8.5(GND) J8.6(Shield) J9.2(Pin_2) J10.2(Pin_2) J11.2(Pin_2) J18.4(Pin_4) J18.5(Pin_5) J19.1(Pin_1) J19.15(Pin_15) J19.16(Pin_16) J19.30(Pin_30) J19.MP(MountPin) Q1.2(S) Q2.2(S) Q3.2(S) Q4.2(S) R2.2 R4.2 R5.2 R11.2 R15.2 R16.2 R19.2 R20.2 R31.2 R37.2 R38.2 R45.2 R47.2 R49.2 R50.2 R52.2 R53.2 SW1.1(A) SW2.1(A) SW4.1(A) U1.9(GND) U1.17(GND) U3.2(NC) U3.4(GNDA) U3.6(GNDIO) U3.10(SDO2) U3.15(SDO1) U4.2(VSS) U5.3(VSS) U5.5(ADR/SDO) U5.8(VSS) U5.9(VSS) U6.1(GND) U6.5(GND) U6.10(AGND) U6.11(GND) U6.13(TEST) U6.15(GND) U6.25(GND) U6.35(GND) U6.47(GND) U6.51(GND) U7.2(EN) U7.5(GND) U8.6(GND) U8.16(GND) U9.2(AVSSVCSEL) U9.3(GND) U9.4(GND) U9.6(GND) U9.12(GND) U10.2(GND) U11.7(GND) U12.2(GND) U13.2(EN) U13.5(GND) U14.1(GND) U14.2(GND) U14.11(GND) U14.14(GND) U14.36(GND) U14.37(GND) U14.38(GND) U14.39(GND) U14.40(GND) U14.41(GND) U14.42(GND) U14.43(GND) U14.44(GND) U14.45(GND) U14.46(GND) U14.47(GND) U14.48(GND) U14.49(GND) U14.50(GND) U14.51(GND) U14.52(GND) U14.53(GND) Y1.2
VCOM: C51.2 C54.2 C55.2 R46.1 SW3.1(A) U11.2(VIN)
VEN_D: C1.1 C36.1 J1.1(VBUS) J8.1(VBUS) R3.1 R11.1 R34.1 U4.4(VDD) U7.8(IN1) U8.15(VCC) U12.1(VIN) U12.3(ON/~{{OFF}})  [also labelled +5V]
ACCEL_INT: J19.25(Pin_25) U3.16(INT1)
CamRST: IC1.7(NRESET) J19.23(Pin_23) U14.5(GPIO2/ADC1_CH2)
CHIP_EN: C37.1 C58.1 Q8.3(C2) R40.2 SW1.2(B) U14.8(EN/CHIP_PU)
DECAP: C8.1 U1.8(DECAP) U1.11(ADDR)
DTR: Q8.1(E1) R35.1 U8.1(~{{DTR}})
FTDI_OSCI: U6.2(OSCI) Y1.1
FTDI_OSCO: U6.3(OSCO) Y1.3
GPIO0: U1.15(AIN0/GPIO0)
GPIO1: J9.5(Pin_5) U1.16(AIN1/GPIO1)
GPIO2: J2.5(Pin_5) U1.1(AIN2/GPIO2)
GPIO3: J11.5(Pin_5) U1.2(AIN3/GPIO3)
GPIO4: J10.5(Pin_5) U1.3(AIN4/GPIO4)
GPIO5: R30.2 R31.1 U1.4(AIN5/GPIO5)
GPIO6: R42.2 U1.5(AIN6/GPIO6) U9.5(XSHUT)
GPIO7: U1.6(AIN7/GPIO7)
GPIO9: C43.1 Q8.6(C1) SW4.2(B) U14.23(GPIO9)
GYRO_INT: J19.9(Pin_9) U3.12(INT3)
INT_BARO: J19.28(Pin_28) U5.7(INT)
IO1: U14.10(MTDI/GPIO5/ADC1_CH5)
IO2: U14.9(MTMS/GPIO4/ADC1_CH4)
JTAG_LED: D12.1(K) U6.29(ACBUS3)
JTAG_TCK_3V3: J19.6(Pin_6) U6.16(ADBUS0)
JTAG_TDI_3V3: J19.5(Pin_5) U6.17(ADBUS1)
JTAG_TDO_3V3: J19.4(Pin_4) U6.18(ADBUS2)
JTAG_TMS_3V3: J19.3(Pin_3) U6.19(ADBUS3)
JTAG_TRSTn_3V3: J19.2(Pin_2) U6.26(ACBUS0)
LED_N: IC1.20(LED_N) J19.12(Pin_12) U14.6(GPIO3/ADC1_CH3)
MISO: IC1.18(MISO) J19.10(Pin_10) U14.24(GPIO18)
MOSI: IC1.16(MOSI) J19.27(Pin_27) U14.16(MTDO/GPIO7)
MOTION: IC1.15(MOTION) J19.26(Pin_26)
MOTOR1: J19.17(Pin_17) R13.1 U14.27(GPIO21)
MOTOR2: J19.14(Pin_14) R17.1 U14.26(GPIO20)
MOTOR3: J19.19(Pin_19) R14.1 U14.29(GPIO23)
MOTOR4: J19.18(Pin_18) R18.1 U14.28(GPIO22)
NCS: IC1.19(NCS) J19.11(Pin_11) U14.25(GPIO19)
OW: U14.13(GPIO1/ADC1_CH1/XTAL_32K_N)
RGB_CTRL: D8.3(DIN) R55.2 U14.22(GPIO8)
RST: J19.29(Pin_29) R33.2
RTS: Q8.4(E2) R36.1 U8.2(~{{RTS}})
RX_LED: D10.1(K) U6.54(BCBUS3)
SCL: J2.3(Pin_3) J9.3(Pin_3) J10.3(Pin_3) J11.3(Pin_3) J19.21(Pin_21) R23.2 R44.2 R56.2 U1.13(SCL) U3.8(SCL/SCK) U5.2(SCL/SCK) U9.10(SCL) U14.19(GPIO14)
SCLK: IC1.17(SCLK) J19.24(Pin_24) U14.15(MTCK/GPIO6/ADC1_CH6)
SDA: J2.4(Pin_4) J9.4(Pin_4) J10.4(Pin_4) J11.4(Pin_4) J19.20(Pin_20) R22.2 R43.2 R57.2 U1.14(SDA) U3.9(SDA/SDI) U5.4(SDA/SDI) U9.9(SDA) U14.20(GPIO15)
SPI{slash}I2C_SEL: J19.22(Pin_22)
TOF_Int: J19.13(Pin_13) R41.2 U9.7(GPIO1)
TX_LED: D11.1(K) U6.55(BCBUS4)
U0RXD: U8.20(TXD) U14.30(U0RXD/GPIO17)
U0TXD: U8.4(RXD) U14.31(U0TXD/GPIO16)
UART0_RX_3V3: J19.7(Pin_7) U6.38(BDBUS0)
UART0_TX_3V3: J19.8(Pin_8) U6.39(BDBUS1)
UART1_RX_3V3: U14.18(GPIO13/USB_D+)
UART1_TX_3V3: U14.17(GPIO12/USB_D-)
USB_DM: J1.2(D-) R21.1
USB_DN: J8.2(D-) U6.7(DM)
USB_DP: J1.3(D+) J8.3(D+) R24.1 U6.8(DP)
VSENSE: R48.2 R49.1 R51.2 R52.1 U11.5(VSENSE) U14.12(GPIO0/ADC1_CH0/XTAL_32K_P)
NetC9_1: C9.1 C10.1 IC1.4(VREG)
NetC11_1: C11.1 C12.1 C13.1 IC1.2(VDD) R25.1
NetC27_1: C27.1 C28.1 FB1.1 U6.9(VPLL)
NetC29_1: C29.1 C30.1 FB2.1 U6.4(VPHY)
NetC32_1: C32.1 C33.1 U6.49(VREGOUT)
NetC34_1: C34.1 SW3.2(B) U7.7(OUT)
NetC44_1: C44.1 U12.4(BP)
NetC47_1: C47.1 U11.1(BOOT)
NetC47_2: C47.2 D14.1(K) L3.1 U11.8(PH)
NetC48_2: C48.2 U11.4(SS)
NetC49_2: C49.2 C50.2 U11.6(COMP)
NetC50_1: C50.1 R47.1
NetD1_2: D1.2(A) R1.2
NetD2_2: D2.2(A) J3.1(Pin_1) Q1.3(D)
NetD3_2: D3.2(A) J5.2(Pin_2) Q2.3(D)
NetD4_2: D4.2(A) R12.2
NetD5_2: D5.2(A) J4.1(Pin_1) Q3.3(D)
NetD6_2: D6.2(A) J6.2(Pin_2) Q4.3(D)
NetD7_1: D7.1(K) U4.1(STAT)
NetD7_2: D7.2(A) R3.2
NetD8_1: D8.1(DOUT) D9.3(DIN)
NetD10_2: D10.2(A) R27.2
NetD11_2: D11.2(A) R28.2
NetD12_2: D12.2(A) R29.2
NetD13_2: D13.2(A) R54.2
NetJB1_8: JB1.8(Pin_8) R9.2
NetJB1_27: JB1.27(Pin_27) R10.2
NetJB1_29: JB1.29(Pin_29) R6.2
NetJB1_31: JB1.31(Pin_31) R7.2
NetJB1_90: JB1.90(Pin_70) R4.1
NetJB2_17: JB2.17(Pin_17) R8.2
NetQ1_1: Q1.1(G) R13.2 R15.1
NetQ2_1: Q2.1(G) R17.2 R19.1
NetQ3_1: Q3.1(G) R14.2 R16.1
NetQ4_1: Q4.1(G) R18.2 R20.1
NetQ8_2: Q8.2(B1) R36.2
NetQ8_5: Q8.5(B2) R35.2
NetR2_1: R2.1 U4.5(PROG)
NetR5_1: R5.1 U6.6(REF)
NetR21_2: R21.2 U8.12(USBDM)
NetR24_2: R24.2 U8.11(USBDP)
NetR26_2: R26.2 U6.14(RESET)
NetR32_2: R32.2 R33.1 SW2.2(B)
NetR34_2: R34.2 U7.3(VSNS)
NetR37_1: R37.1 U7.4(ILIM)
NetR38_1: R38.1 U7.1(STAT)
NetR39_2: R39.2 U13.3(VSNS)
NetR45_1: R45.1 R46.2 U11.3(EN)
NetR50_1: R50.1 U13.4(ILIM)
NetR53_1: R53.1 U13.1(STAT)

Not connected (* = marked no-connect by the designer): D9 1(DOUT)*; IC1 5(NC_1) 6(NC_2) 8(NC_3) 9(NC_4) 10(NC_5) 11(NC_6) 12(NC_7) 13(NC_8) 14(NC_9) 22(NC_10) 23(NC_11) 24(NC_12) 25(NC_13) 26(NC_14) 27(NC_15) 28(NC_16); J1 4(ID)*; J8 4(ID)*; J13 1(Pin_1) 2(Pin_2) 3(Pin_3) 4(Pin_4) 5(Pin_5) 6(Pin_6) 7(Pin_7) 8(Pin_8) 9(Pin_9) 10(Pin_10) 11(Pin_11) 12(Pin_12) 13(Pin_13) 14(Pin_14) 15(Pin_15) 16(Pin_16) 17(Pin_17) 18(Pin_18) 19(Pin_19) 20(Pin_20) 21(Pin_21) 22(Pin_22) 23(Pin_23) 24(Pin_24) MP(MountPin); J18 MP(MountPin); JB1 1(Pin_1) 2(Pin_2) 3(Pin_3) 4(Pin_4) 5(Pin_5) 6(Pin_6) 7(Pin_7) 9(Pin_9) 10(Pin_10) 11(Pin_11) 12(Pin_12) 13(Pin_13) 14(Pin_14) 15(Pin_15) 16(Pin_16) 17(Pin_17) 18(Pin_18) 19(Pin_19) 20(Pin_20) 21(Pin_21) 22(Pin_22) 23(Pin_23) 24(Pin_24) 25(Pin_25) 26(Pin_26) 28(Pin_28) 30(Pin_30) 32(Pin_32) 33(Pin_33) 34(Pin_34) 35(Pin_35) 36(Pin_36) 37(Pin_37) 38(Pin_38) 39(Pin_39) 40(Pin_40) 41(Pin_41) 42(Pin_42) 43(Pin_43) 44(Pin_44) 45(Pin_45) 46(Pin_46) 47(Pin_47) 48(Pin_48) 49(Pin_49) 50(Pin_50) 51(Pin_51) 52(Pin_52) 53(Pin_53) 54(Pin_54) 55(Pin_55) 56(Pin_56) 57(Pin_57) 58(Pin_58) 59(Pin_59) 60(Pin_60) 61(Pin_61) 62(Pin_62) 63(Pin_63) 64(Pin_64) 65(Pin_65) 66(Pin_66) 67(Pin_67) 68(Pin_68) 69(Pin_69) 70(Pin_70) 71(Pin_71) 72(Pin_72) 73(Pin_73) 74(Pin_74) 75(Pin_75) 76(Pin_76) 77(Pin_77) 78(Pin_78) 79(Pin_79) 80(Pin_80) 81(Pin_61) 82(Pin_62) 83(Pin_63) 84(Pin_64) 85(Pin_65) 86(Pin_66) 87(Pin_67) 88(Pin_68) 89(Pin_69) 91(Pin_71) 92(Pin_72) 93(Pin_73) 94(Pin_74) 95(Pin_75) 96(Pin_76) 97(Pin_77) 98(Pin_78) 99(Pin_79) 100(Pin_80) SH(Shield); JB2 1(Pin_1) 2(Pin_2) 3(Pin_3) 4(Pin_4) 5(Pin_5) 6(Pin_6) 7(Pin_7) 8(Pin_8) 9(Pin_9) 10(Pin_10) 11(Pin_11) 12(Pin_12) 13(Pin_13) 14(Pin_14) 15(Pin_15) 16(Pin_16) 18(Pin_18) 19(Pin_19) 20(Pin_20) 21(Pin_21) 22(Pin_22) 23(Pin_23) 24(Pin_24) 25(Pin_25) 26(Pin_26) 27(Pin_27) 28(Pin_28) 29(Pin_29) 30(Pin_30) 31(Pin_31) 32(Pin_32) 33(Pin_33) 34(Pin_34) 35(Pin_35) 36(Pin_36) 37(Pin_37) 38(Pin_38) 39(Pin_39) 40(Pin_40) 41(Pin_41) 42(Pin_42) 43(Pin_43) 44(Pin_44) 45(Pin_45) 46(Pin_46) 47(Pin_47) 48(Pin_48) 49(Pin_49) 50(Pin_50) 51(Pin_51) 52(Pin_52) 53(Pin_53) 54(Pin_54) 55(Pin_55) 56(Pin_56) 57(Pin_57) 58(Pin_58) 59(Pin_59) 60(Pin_60) 61(Pin_61) 62(Pin_62) 63(Pin_63) 64(Pin_64) 65(Pin_65) 66(Pin_66) 67(Pin_67) 68(Pin_68) 69(Pin_69) 70(Pin_70) 71(Pin_71) 72(Pin_72) 73(Pin_73) 74(Pin_74) 75(Pin_75) 76(Pin_76) 77(Pin_77) 78(Pin_78) 79(Pin_79) 80(Pin_80) 81(Pin_61) 82(Pin_62) 83(Pin_63) 84(Pin_64) 85(Pin_65) 86(Pin_66) 87(Pin_67) 88(Pin_68) 89(Pin_69) 90(Pin_70) 91(Pin_71) 92(Pin_72) 93(Pin_73) 94(Pin_74) 95(Pin_75) 96(Pin_76) 97(Pin_77) 98(Pin_78) 99(Pin_79) 100(Pin_80) SH(Shield); JB3 1(Pin_1) 2(Pin_2) 3(Pin_3) 4(Pin_4) 5(Pin_5) 6(Pin_6) 7(Pin_7) 8(Pin_8) 9(Pin_9) 10(Pin_10) 11(Pin_11) 12(Pin_12) 13(Pin_13) 14(Pin_14) 15(Pin_15) 16(Pin_16) 17(Pin_17) 18(Pin_18) 19(Pin_19) 20(Pin_20) 21(Pin_21) 22(Pin_22) 23(Pin_23) 24(Pin_24) 25(Pin_25) 26(Pin_26) 27(Pin_27) 28(Pin_28) 29(Pin_29) 30(Pin_30) 31(Pin_31) 32(Pin_32) 33(Pin_33) 34(Pin_34) 35(Pin_35) 36(Pin_36) 37(Pin_37) 38(Pin_38) 39(Pin_39) 40(Pin_40) 41(Pin_41) 42(Pin_42) 43(Pin_43) 44(Pin_44) 45(Pin_45) 46(Pin_46) 47(Pin_47) 48(Pin_48) 49(Pin_49) 50(Pin_50) 51(Pin_51) 52(Pin_52) 53(Pin_53) 54(Pin_54) 55(Pin_55) 56(Pin_56) 57(Pin_57) 58(Pin_58) 59(Pin_59) 60(Pin_60) SH(Shield); U1 12(ALERT)*; U3 1(INT2)* 5(CSB2)* 13(INT4)*; U6 21(ADBUS4) 22(ADBUS5) 23(ADBUS6) 24(ADBUS7) 27(ACBUS1) 28(ACBUS2) 30(ACBUS4) 32(ACBUS5) 33(ACBUS6) 34(ACBUS7) 36(SUSPEND) 40(BDBUS2) 41(BDBUS3) 43(BDBUS4) 44(BDBUS5) 45(BDBUS6) 46(BDBUS7) 48(BCBUS0) 52(BCBUS1) 53(BCBUS2) 57(BCBUS5) 58(BCBUS6) 59(BCBUS7) 60(PWREN); U8 5(~{{RI}})* 7(~{{DSR}})* 8(~{{DCD}})* 9(~{{CTS}})* 10(CBUS2)* 13(3V3OUT)* 17(CBUS1)* 18(CBUS0)* 19(CBUS3)*; U9 8(DNC); U14 4(NC) 7(NC) 21(NC) 32(NC) 33(NC) 34(NC) 35(NC)

## Notes on the sheet
- a
- Power B2B
- Signal B2B
- What is this (SPI/I2C_SEL)
- (near H1) Plastic screws
- (near R9) CPLD PWR Management
- NOTE: Connect to something
- TODO HM01B0 Camera OctoSpi (To FPGA over GPIOs)
- ADDR = 111011X
- idk what this is for and if we need it...
- (near R4) Low=FPGA
- 1
- 2
- 3
- 4
- 5
- 6
- 7
- 8
- 9
- 10
- 11
- A
- B
- C
- D
- E
- F
- G
- H
- Title:
- File: riskybirdv3.kicad_sch
- Sheet: /
- KiCad E.D.A.  kicad (5.1.4)-1
- Size: A2
- Date:
- Rev:
- Id: 1/1
- (in symbol Conn_01x05_MountingPin) Mounting
- (in symbol Conn_01x30_MountingPin) Mounting
- (in symbol Conn_02x12_Odd_Even_MountingPin) Mounting
- (in symbol Conn_02x30_Odd_Even_Shielded) GROUP8; GND; GROUP2; GND\n; USB_OTG_D_P; USB_OTG_D_N; USB_OTG_ID; USB_VBUS_V_EN; USB_VBUS
- (in symbol Conn_02x40_Odd_Even_Shielded) PWR_1; GND; GROUP7; NOSEQ; VCCIOA; PWR_2; GROUP5; SC_EN1; SC_PGOOD; GROUP1; SC_BOOTMODE; PWR_M2; PWR_VBAT; UART_TX; GROUP6; JTAGSEL; UART_RX
- (in symbol Conn_02x40_Odd_Even_Shielded_1) VCCIOB; PWR_1; VCCIOC; VCCIOD; PWR_M1; GROUP3; SC_nRST; PWR_M3/NC; GND; GROUP4; PWR_JTAG; TMS; TDI; TDO; TCK
- (in symbol ESP32-C6-MINI-1/U) ESP32-C6-MINI-1
- (in symbol SK6812MINI) RGB

## Library data of the parts
C1 C16 C17 C26 C34-C37 C43-C59 = C
  C1 C26 C36 C45 C57: Value: 4.7u
  C16 C17: Value: 100n
  C34 C59: Value: 1u
  C35 C37 C43 C56 C58: Value: 0.1u
  C44: Value: 10n
  C46: Value: 10u
  C47: Value: 0.1uF
  C48 C54: Value: 0.01uF
  C49: Value: 1000pF
  C50: Value: 47pF
  C51 C55: Value: 4.7uF
  C52 C53: Value: 47uF
C2-C15 C18-C25 C27-C33 C38-C42 = C_Small
  C2 C3 C40 C41: Value: 47uF
  C4-C7 C10 C13 C15 C18-C22 C24 C25 C27 C29 C31 C33 C38: Value: 100nF
  C8 C42: Value: 1uF
  C9 C28 C30 C39: Value: 4.7uF
  C11 C12: Value: 22uF
  C14 C23: Value: 10uF
  C32: Value: 3.3uF
D2 D3 D5 D6 = BAT54J: Value: BAT54JFILM
D7 D13 = LED
  D7: Value: LED_RED
  D13: Value: LED_BLUE
FB1 FB2 = FerriteBead: Value: 600R@100MHz/0.5A
JB1 = Conn_02x40_Odd_Even_Shielded: Value: Conn_02x50_Odd_Even_Shielded
JB2 = Conn_02x40_Odd_Even_Shielded_1: Value: Conn_02x50_Odd_Even_Shielded
L3 = L: Value: 6.8uH
Q1-Q4 = Q_NMOS_GSD: Value: SI2302
R1-R4 R6-R21 R24 R27-R29 R34-R40 R45-R57 = R
  R1 R3 R12 R27-R29 R37 R50 R54: Value: 150
  R2: Value: 2k
  R4 R6-R11 R15 R16 R19 R20 R34-R36 R38-R40 R53 R55: Value: 10k
  R13 R14 R17 R18: Value: 47R
  R21 R24: Value: 27
  R45: Value: 68.1k
  R46: Value: 332k
  R47: Value: 29.4k
  R48: Value: 10.2k
  R49: Value: 3.24k
  R51: Value: 200k
  R52: Value: 100k
  R56 R57: Value: 4.7k
R5 R22 R23 R25 R26 R30-R33 R41-R44 = R_Small
  R5: Value: 12k
  R22 R23 R43 R44: Value: 4.7K
  R25: Value: 3
  R26: Value: 1k
  R30: Value: 200K
  R31: Value: 100K
  R32: Value: 10K
  R33: Value: 100
  R41 R42: Value: 10k
U4 = MCP73831-2-OT-Battery_Management: Value: MCP73831-2-OT
U5 = BMP390
U7 U13 = TPS2113A-slice: Value: TPS2113A
Y1 = CSTNE12M0G550000R0: Value: f
D1 D4 D10-D12 = LED: Value: LED
D8 D9 = SK6812MINI: Value: SK6812MINI
D14 = BAT54J: Value: BAT54J
H1-H4 = MountingHole: Value: MountingHole
IC1 = PMW3901MB-TXQT: Description: PMW3901MB-TXQT; Manufacturer_Part_Number: PMW3901MB-TXQT; Value: PMW3901MB-TXQT
J1 J8 = USB_B_Micro: Value: USB_B_Micro
J2 J9-J11 = Conn_01x05: Value: Conn_01x05
J3-J7 = Conn_01x02: Value: Conn_01x02
J13 = Conn_02x12_Odd_Even_MountingPin: Value: Conn_02x12_Odd_Even_MountingPin
J18 = Conn_01x05_MountingPin: Value: Conn_01x05_MountingPin
J19 = Conn_01x30_MountingPin: Value: Conn_01x30_MountingPin
JB3 = Conn_02x30_Odd_Even_Shielded: Value: Conn_02x30_Odd_Even_Shielded
Q8 = BC847BDW1: Value: BC847BDW1
SW1-SW4 = SW_SPST: Value: SW_SPST
TP1 TP6 = TestPoint: Value: TestPoint
U1 = ADS7128IRTER: Value: ADS7128IRTER
U3 = BMI088: PURCHASE-URL: https://pricing.snapeda.com/search/part/BMI088/?ref=eda; MP: BMI088; Value: BMI088
U6 = FT2232HL-REEL: MPN: FT2232HL-REEL; DK_Datasheet_Link: https://www.ftdichip.com/Support/Documents/DataSheets/ICs/DS_FT2232H.pdf; Description_1: IC USB HS DUAL UART/FIFO 64-LQFP; Value: FT2232HL-REEL
U8 = FT231XS: Value: FT231XS
U9 = VL53L1CXV0FY1: Value: VL53L1CXV0FY1
U10 = TLV70018DCKR: Value: TLV70018DCKR
U11 = TPS54331D: Value: TPS54331D
U12 = LP2985-3.0: Value: LP2985-3.0
U14 = ESP32-C6-MINI-1/U: Value: ESP32-C6-MINI-1/U